# Altium schematic sheet Connectors.SchDoc
size A; SheetNumber: 3; SheetTotal: 5
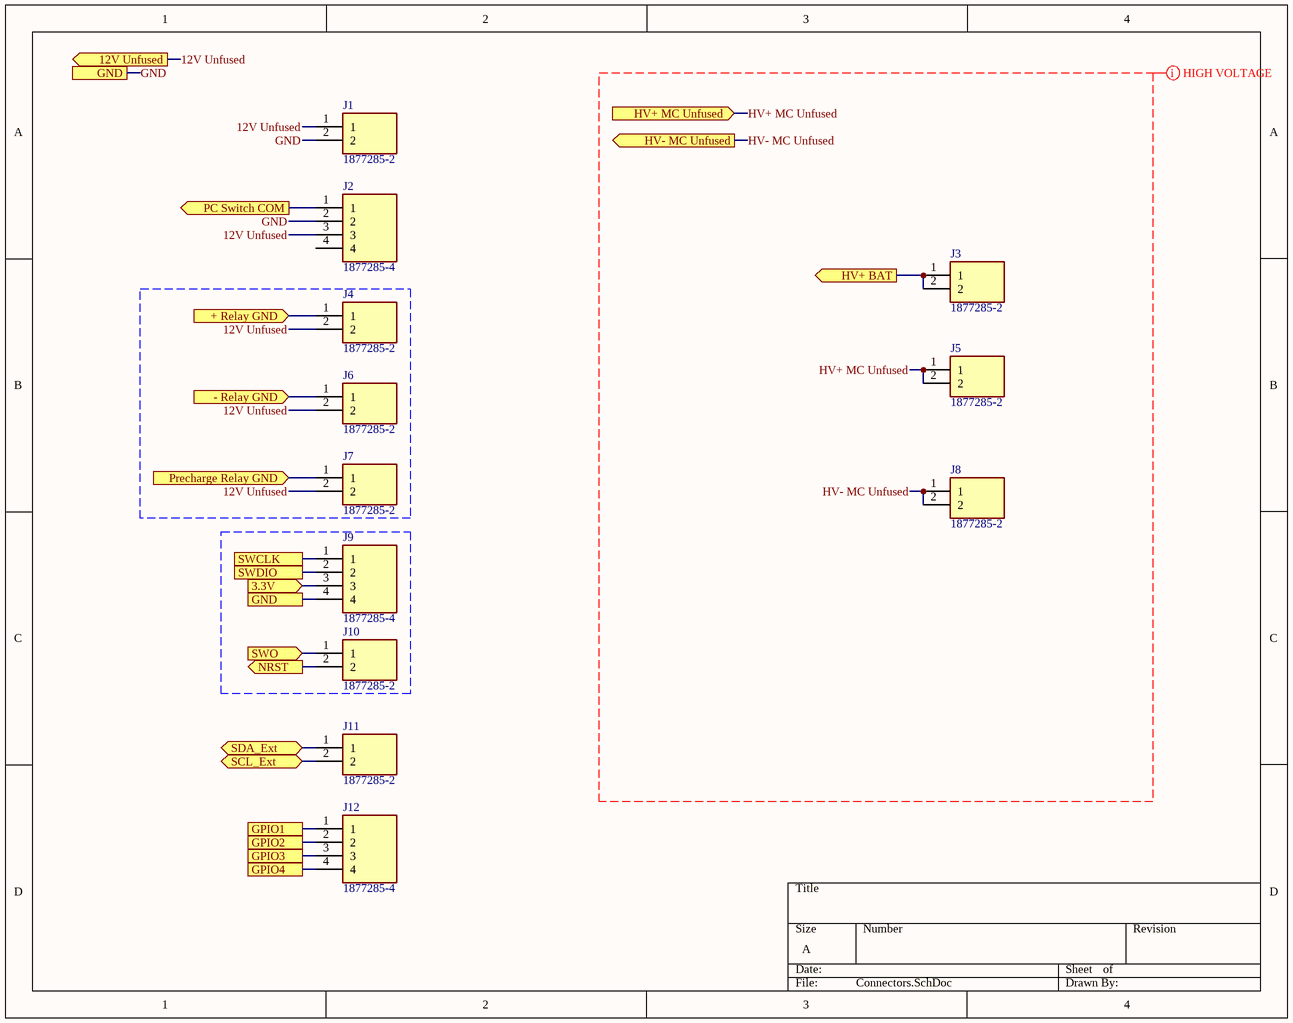
[diagram p0: Connectors.SchDoc]

## Parts
J1  1877285-2  [18772852]
J2  1877285-4  [18772854]
J3  1877285-2  [18772852]
J4  1877285-2  [18772852]
J5  1877285-2  [18772852]
J6  1877285-2  [18772852]
J7  1877285-2  [18772852]
J8  1877285-2  [18772852]
J9  1877285-4  [18772854]
J10  1877285-2  [18772852]
J11  1877285-2  [18772852]
J12  1877285-4  [18772854]

## Ports
3.3V (in), 12V Unfused (out), + Relay GND (in), - Relay GND (in), GND, GPIO1, GPIO2, GPIO3, GPIO4, HV+ BAT (out), HV+ MC Unfused (in), HV- MC Unfused (out), NRST (out), PC Switch COM (out), Precharge Relay GND (in), SCL_Ext (bidir), SDA_Ext (bidir), SWCLK, SWDIO, SWO (in)

## Nets
3.3V: J9.3 ; port 3.3V
12V Unfused: J1.1 J2.3 J4.2 J6.2 J7.2 ; port 12V Unfused
+ Relay GND: J4.1 ; port + Relay GND
- Relay GND: J6.1 ; port - Relay GND
GND: J1.2 J2.2 J9.4 ; port GND
GPIO1: J12.1 ; port GPIO1
GPIO2: J12.2 ; port GPIO2
GPIO3: J12.3 ; port GPIO3
GPIO4: J12.4 ; port GPIO4
HV+ BAT: J3.1 J3.2 ; port HV+ BAT
HV+ MC Unfused: J5.1 J5.2 ; port HV+ MC Unfused
HV- MC Unfused: J8.1 J8.2 ; port HV- MC Unfused
NRST: J10.2 ; port NRST
PC Switch COM: J2.1 ; port PC Switch COM
Precharge Relay GND: J7.1 ; port Precharge Relay GND
SCL_Ext: J11.2 ; port SCL_Ext
SDA_Ext: J11.1 ; port SDA_Ext
SWCLK: J9.1 ; port SWCLK
SWDIO: J9.2 ; port SWDIO
SWO: J10.1 ; port SWO

Not connected (* = marked no-connect by the designer): J2 4

## Layout directives
mark named HIGH VOLTAGE: HV+ MC Unfused, HV- MC Unfused

## Library data of the parts
J1 J3-J8 J10 J11 = 1877285-2: Connector; Manufacturer_Name: TE Connectivity; Datasheet Link: https://www.te.com/commerce/DocumentDelivery/DDEController?Action=srchrtrv&DocNm=7-1773458-5_ECONOMY_POWER_QRG&DocType=Data%20Sheet&DocLang=English&PartCntxt=1877285-2&DocFormat=pdf; Height: 12mm; Manufacturer_Part_Number: 1877285-2; Mouser Part Number: 571-1877285-2; Mouser Price/Stock: https://www.mouser.co.uk/ProductDetail/TE-Connectivity/1877285-2?qs=ka3zfMQDmFlAIZq5pDt5JA%3D%3D; Arrow Part Number: 1877285-2; Arrow Price/Stock: https://www.arrow.com/en/products/1877285-2/te-connectivity?region=europe
J2 J9 J12 = 1877285-4: Connector; Manufacturer_Name: TE Connectivity; Datasheet Link: https://www.te.com/commerce/DocumentDelivery/DDEController?Action=srchrtrv&DocNm=1877285&DocType=Customer%20Drawing&DocLang=English&PartCntxt=1877285-4&DocFormat=pdf; Height: 12.5mm; Manufacturer_Part_Number: 1877285-4; Mouser Part Number: 571-1877285-4; Mouser Price/Stock: https://www.mouser.co.uk/ProductDetail/TE-Connectivity/1877285-4?qs=ka3zfMQDmFkZPBtotDIXvQ%3D%3D; Arrow Part Number: 1877285-4; Arrow Price/Stock: https://www.arrow.com/en/products/1877285-4/te-connectivity?region=nac